# Altium schematic sheet Main_PDSplitter.SchDoc: USB PD Splitter
size A4; DrawnBy: Fabian Hochberg; Organization: KIT; Address1: Elektrotechnisches Institut; Address2: Engelbert-Arnold-Str. 5; Address3: 76131 Karlsruhe; DocumentNumber: 1; Revision: 1.0; SheetNumber: 1; SheetTotal: 2
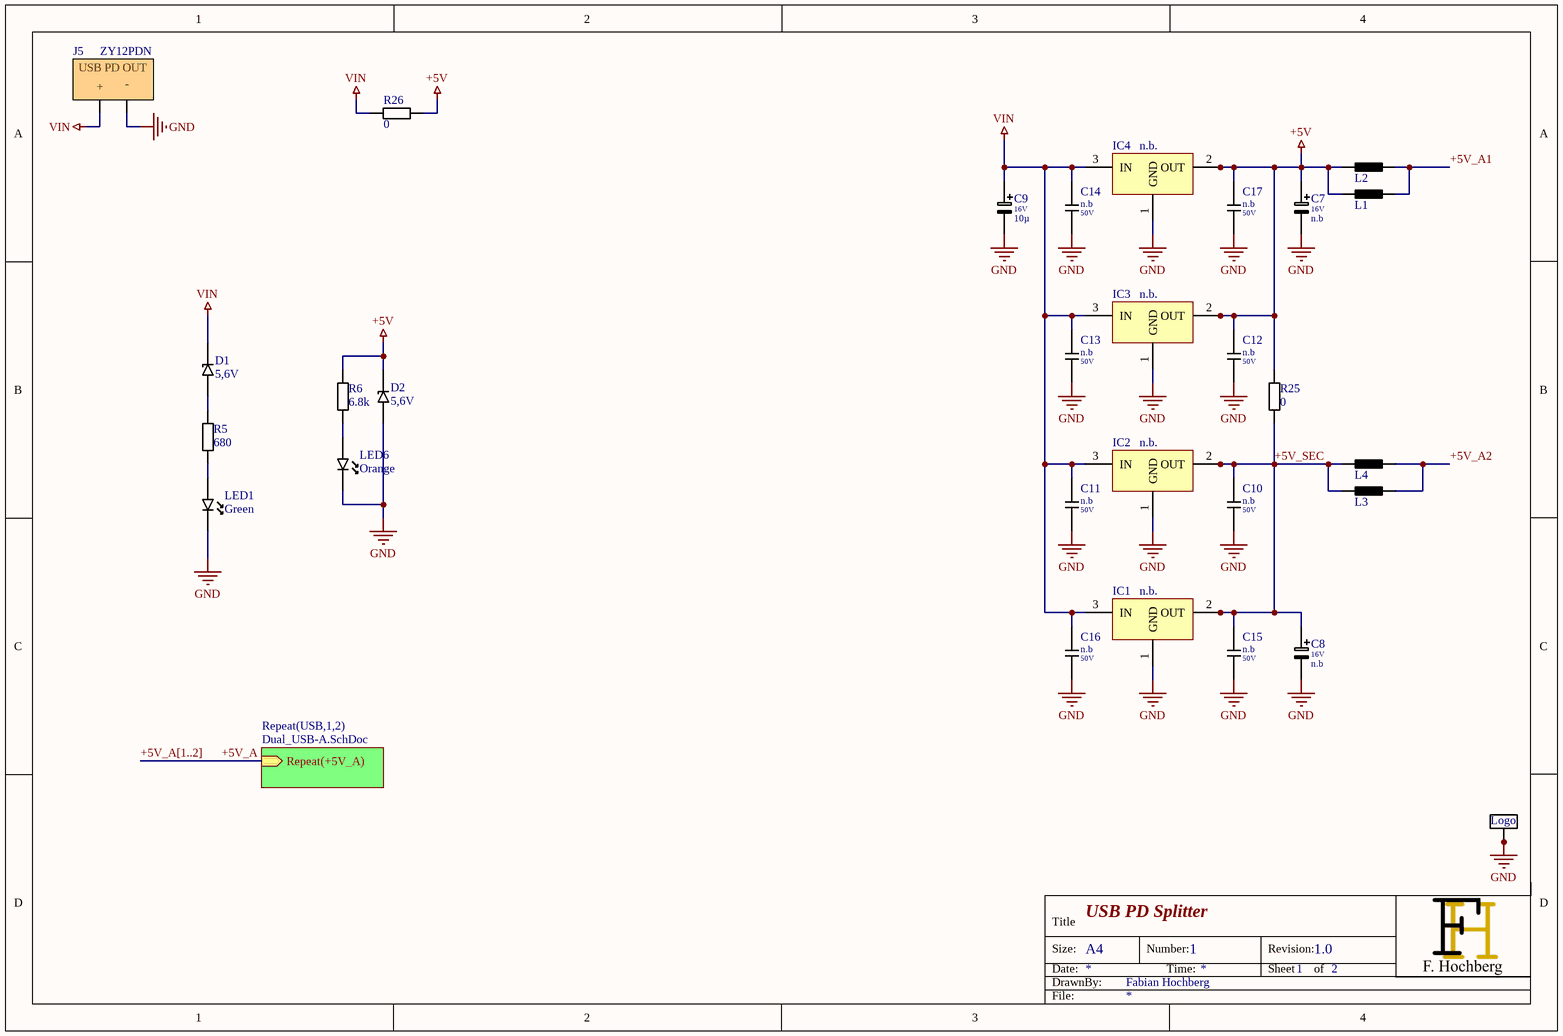
[diagram p0: Main_PDSplitter.SchDoc]

## Parts
C7  value n.b  Voltage: 16V  [CAPAE_4x5.4]  (hidden comment: n.b.)
C8  value n.b  Voltage: 16V  [CAPAE_4x5.4]  (hidden comment: n.b.)
C9  value 10µ  Voltage: 16V  [CAPAE_4x5.4]  (hidden comment: 10µ_16V)
C10  value n.b  Voltage: 50V  [0603_C]  (hidden comment: n.b.)
C11  value n.b  Voltage: 50V  [0603_C]  (hidden comment: n.b.)
C12  value n.b  Voltage: 50V  [0603_C]  (hidden comment: n.b.)
C13  value n.b  Voltage: 50V  [0603_C]  (hidden comment: n.b.)
C14  value n.b  Voltage: 50V  [0603_C]  (hidden comment: n.b.)
C15  value n.b  Voltage: 50V  [0603_C]  (hidden comment: n.b.)
C16  value n.b  Voltage: 50V  [0603_C]  (hidden comment: n.b.)
C17  value n.b  Voltage: 50V  [0603_C]  (hidden comment: n.b.)
D1  5,6V  [MINIMELF-SOD80]
D2  5,6V  [MINIMELF-SOD80]
IC1  n.b.  [SOT223]
IC2  n.b.  [SOT223]
IC3  n.b.  [SOT223]
IC4  n.b.  [SOT223]
J5  ZY12PDN  [ZY12PDN_BRPCB]
L1  100 Ohm @ 100MHz  [0603_L]  (value not drawn)
L2  100 Ohm @ 100MHz  [0603_L]  (value not drawn)
L3  100 Ohm @ 100MHz  [0603_L]  (value not drawn)
L4  100 Ohm @ 100MHz  [0603_L]  (value not drawn)
LED1  Green  [0603_LED]
LED6  Orange  [0603_LED]
Logo_FH1  Logo  [Logo FH]  (value not drawn)
R5  680  [0603_R]
R6  6.8k  [0603_R]
R25  0  [0603_R]
R26  0  [0603_R]

## Sub-sheets
Repeat(USB,1,2) = Dual_USB-A.SchDoc: Repeat(+5V_A) (in)

## Nets
+5V: C7.1 C12.1 C17.1 D2.2(K) IC3.2(OUT) IC3.4(OUT) IC4.2(OUT) IC4.4(OUT) L1.1 L2.1 R6.2 R25.1 R26.1
GND: C7.2 C8.2 C9.2 C10.2 C11.2 C12.2 C13.2 C14.2 C15.2 C16.2 C17.2 D2.1(A) IC1.1(GND) IC2.1(GND) IC3.1(GND) IC4.1(GND) J5.2(-) LED1.1(K) LED6.1(K) Logo_FH1.1 Logo_FH1.2 Logo_FH1.3 Logo_FH1.4
VIN: C9.1 C11.1 C13.1 C14.1 C16.1 D1.2(K) IC1.3(IN) IC2.3(IN) IC3.3(IN) IC4.3(IN) J5.1(+) R26.2
+5V_A: sheet Repeat(USB,1,2)/Repeat(+5V_A)
+5V_A1: L1.2 L2.2
+5V_A2: L3.2 L4.2
+5V_SEC: C8.1 C10.1 C15.1 IC1.2(OUT) IC1.4(OUT) IC2.2(OUT) IC2.4(OUT) L3.1 L4.1 R25.2
NetD1_1: D1.1(A) R5.2
NetLED1_2: LED1.2(A) R5.1
NetLED6_2: LED6.2(A) R6.1

## Buses and harness runs
bus +5V_A[1..2]

## Notes on the sheet
- Title
- Size:
- Date:
- DrawnBy:
- A4
- Number:
- Time:
- Revision:
- Sheet
- of
- File:
- (in symbol ZY12PDN) USB PD OUT

## Library data of the parts
C7-C9 = C POL: Elko
C10 C12 C15 C17 = C: Keramikkondensator
C11 C13 C14 C16 = C: Keramikkondensator; Designation: 0603 0.1 uF 16 V ±10% Tolerance X7R SMT Multilayer Ceramic Capacitor
D1 D2 = Zener Diode: Voltage: 5,6V
IC1-IC4 = LD1117AG: Fixedvoltage LDO, Pinassignment A; Voltage: 5V; Designation: Low Dropout Regulators 5V; Id: *
L1-L4 = L: 0,15 Ohm 1A max / 100 Ohm @ 100MHz; EBS_Nummer: 10111; HelpURL: https://ebs.eti.kit.edu/Artikel/Detailansicht/10111
LED1 LED6 = LED
  LED1: Color: Green
  LED6: Color: Orange
Logo_FH1 = Logo: 8x8 mm Logo Fabian Hochberg
R5 R6 R25 R26 = R
  R5: Value: 680
  R6: Value: 6.8k
  R25 R26: Value: 0